# EAGLE schematic bracelet (EAGLE 9.6.2)
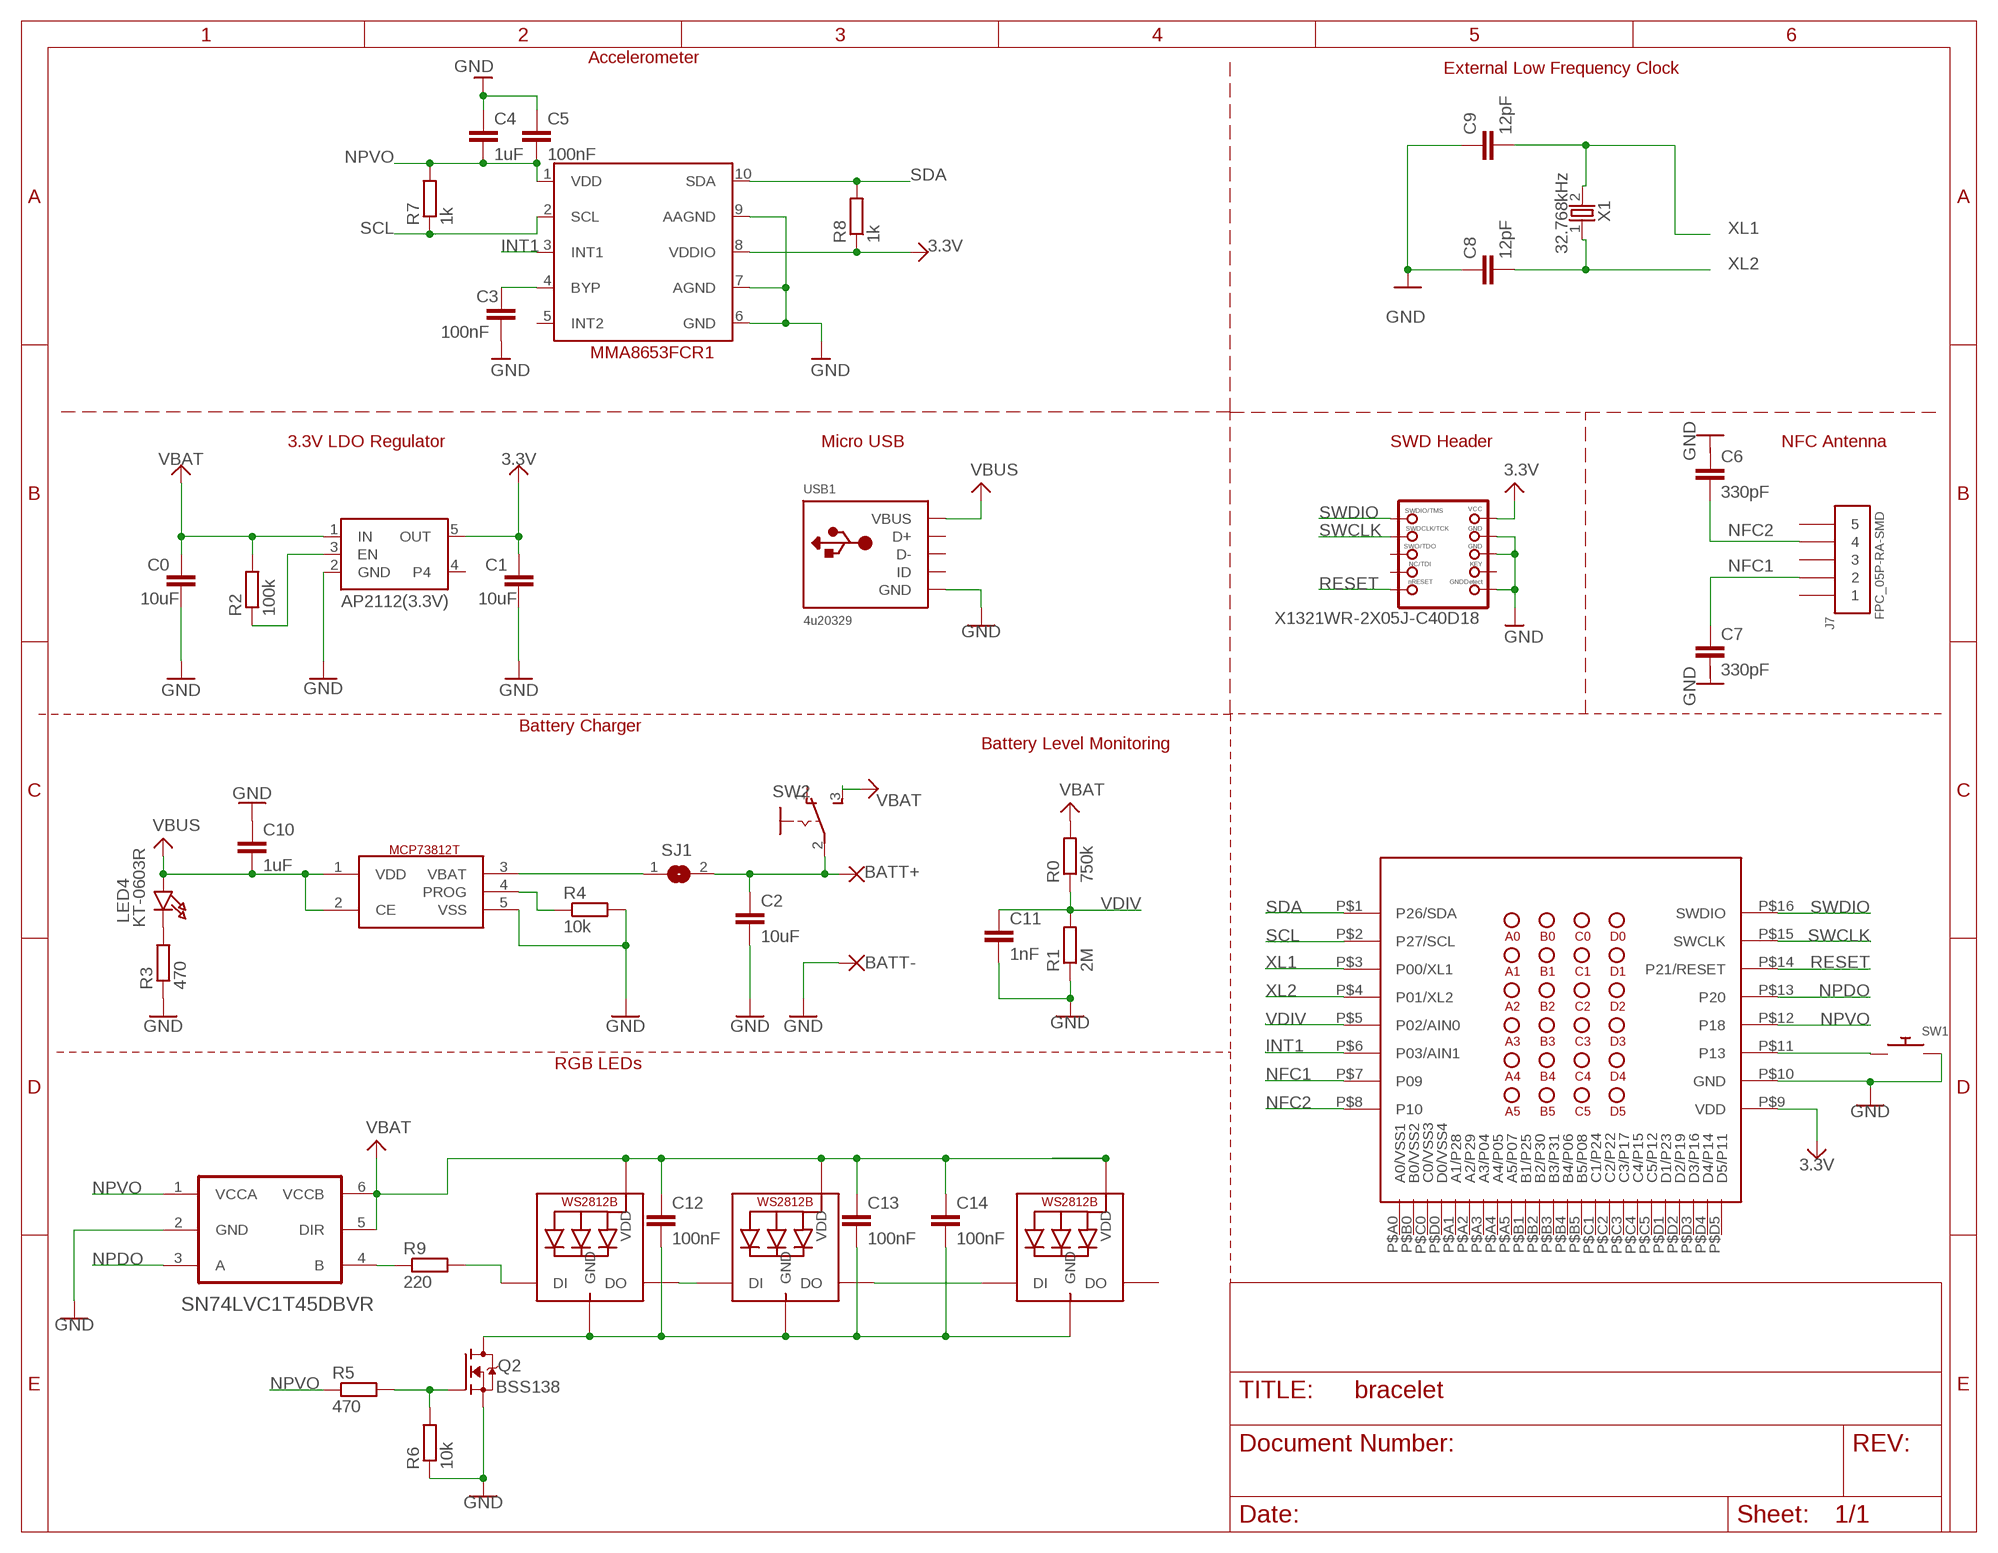
[diagram p0: schematic, sheet 1]

## Parts
BATT+  WIREPADSMD2,54-5,08  [SMD2,54-5,08]
BATT-  WIREPADSMD2,54-5,08  [SMD2,54-5,08]
C0  10uF  CAPACITOR_0402_N  [RESC0402_N]
C1  10uF  CAPACITOR_0402_N  [RESC0402_N]
C2  10uF  C-EUC0402  [C0402]
C3  100nF  C-EUC0402  [C0402]
C4  1uF  C-EUC0402  [C0402]
C5  100nF  C-EUC0402  [C0402]
C6  330pF  C-EUC0402  [C0402]
C7  330pF  C-EUC0402  [C0402]
C8  12pF  C-EUC0402  [C0402]
C9  12pF  C-EUC0402  [C0402]
C10  1uF  C-EUC0402  [C0402]
C11  1nF  C-EUC0402  [C0402]
C12  100nF  C-EUC0402  [C0402]
C13  100nF  C-EUC0402  [C0402]
C14  100nF  C-EUC0402  [C0402]
J1  X1321WR-2X05J-C40D18  JTAG-CORTEXBOXPOSTS  [2X05_1.27MM_BOX_POSTS]
J7  FPC_05P-RA-SMD  [FPC_05P-RA-SMD]
LED1  WS2812B5050  [WS2812B]
LED2  WS2812B5050  [WS2812B]
LED3  WS2812B5050  [WS2812B]
LED4  LED0805_NOOUTLINE  [CHIPLED_0805_NOOUTLINE]
MMA8653FCR1  MMA8653FCR1  [MMA8653FCR1]
Q2  BSS138  [SOT95P240X111-3N]
R0  750k  R-EU_R0603  [R0603]
R1  2M  R-EU_R0603  [R0603]
R2  100k  R-EU_R0402  [R0402]
R3  470  R-EU_R0402  [R0402]
R4  10k  R-EU_R0402  [R0402]
R5  470  R-EU_R0402  [R0402]
R6  10k  R-EU_R0402  [R0402]
R7  1k  R-EU_R0402  [R0402]
R8  1k  R-EU_R0402  [R0402]
R9  220  R-EU_R0402  [R0402]
SJ1  SJ  [SJ]
SW1  SWITCH_PUSHBUTTONSOFTTOUCHSMD_SJ  [PUSHBUTTON_SMD_SJ]
SW2  255SB  [255SB]
U1  BT832L  [BT832L]
U2  SN74LVC1T45DBVR  [SOT95P280X145-6N]
U3  AP2112(3.3V)  VREG_SOT23-5  [SOT23-5]
U$5  MCP73812T-420I/OT  [MCP73812T-420I/OT]
USB1  4u20329  USB_MICRO_20329_V2  [4UCONN_20329_V2]
X1  32.768kHz  XTAL_32KHZ  [XTAL_3215_N]

## Nets
3.3V: C1.1 J1.1(VCC) MMA8653FCR1.8(VDDIO) R8.1 U1.P$9(VDD) U3.5(OUT)
GND: BATT-.1(P) C0.2 C1.2 C2.2 C3.2 C4.1 C5.1 C8.1 C9.1 C10.1 C11.2 J1.3(GND) J1.5(GND) J1.9(GNDDETECT) MMA8653FCR1.6(GND) MMA8653FCR1.7(AGND) MMA8653FCR1.9(AAGND) Q2.2(S) R1.1 R3.1 R4.2 R6.1 SW1.P$2 U1.P$10(GND) U2.2(GND) U3.2(GND) U$5.5(VSS) USB1.BASE@1(GND) USB1.BASE@2(GND) USB1.GND USB1.SPRT@1(GND) USB1.SPRT@2(GND) USB1.SPRT@3(GND) USB1.SPRT@4(GND)
INT1: MMA8653FCR1.3(INT1) U1.P$6(P03/AIN1)
N$1: LED1.2-DOUT(DO) LED2.4-DIN(DI)
N$2: BATT+.1(P) C2.1 SJ1.2 SW2.2(P)
N$3: SW1.P$1 U1.P$11(P13)
N$4: R9.1 U2.4(B)
N$5: LED4.C R3.2
N$6: R2.1 U3.3(EN)
N$7: LED2.2-DOUT(DO) LED3.4-DIN(DI)
N$8: SJ1.1 U$5.3(VBAT)
N$10: Q2.1(G) R5.2 R6.2
N$11: LED1.4-DIN(DI) R9.2
N$12: R4.1 U$5.4(PROG)
N$13: C12.2 C13.2 C14.2 LED1.3-GND(GND) LED2.3-GND(GND) LED3.3-GND(GND) Q2.3(D)
N$14: C3.1 MMA8653FCR1.4(BYP)
NFC1: C7.1 J7.2 U1.P$7(P09)
NFC2: C6.2 J7.4 U1.P$8(P10)
NPDO: U1.P$13(P20) U2.3(A)
NPVO: C4.2 C5.2 MMA8653FCR1.1(VDD) R5.1 R7.2 U1.P$12(P18) U2.1(VCCA)
RESET: J1.10(NRESET) U1.P$14(P21/RESET)
SCL: MMA8653FCR1.2(SCL) R7.1 U1.P$2(P27/SCL)
SDA: MMA8653FCR1.10(SDA) R8.2 U1.P$1(P26/SDA)
SWCLK: J1.4(SWDCLK) U1.P$15(SWCLK)
SWDIO: J1.2(SWDIO) U1.P$16(SWDIO)
VBAT: C0.1 C12.1 C13.1 C14.1 LED1.1-VDD(VDD) LED2.1-VDD(VDD) LED3.1-VDD(VDD) R0.2 R2.2 SW2.3(S) U2.5(DIR) U2.6(VCCB) U3.1(IN)
VBUS [power]: C10.2 LED4.A U$5.1(VDD) U$5.2(CE) USB1.VBUS
VDIV: C11.1 R0.1 R1.2 U1.P$5(P02/AIN0)
XL1: C9.2 U1.P$3(P00/XL1) X1.2
XL2: C8.2 U1.P$4(P01/XL2) X1.1
Unconnected: C6.1 C7.2 J1.6(SWO) J1.7(KEY) J1.8(TDI) J7.1 J7.3 J7.5 LED3.2-DOUT(DO) MMA8653FCR1.5(INT2) SW2.1(O) U1.P$A0(A0/VSS1) U1.P$A1(A1/P28) U1.P$A2(A2/P29) U1.P$A3(A3/P04) U1.P$A4(A4/P05) U1.P$A5(A5/P07) U1.P$B0(B0/VSS2) U1.P$B1(B1/P25) U1.P$B2(B2/P30) U1.P$B3(B3/P31) U1.P$B4(B4/P06) U1.P$B5(B5/P08) U1.P$C0(C0/VSS3) U1.P$C1(C1/P24) U1.P$C2(C2/P22) U1.P$C3(C3/P17) U1.P$C4(C4/P15) U1.P$C5(C5/P12) U1.P$D0(D0/VSS4) U1.P$D1(D1/P23) U1.P$D2(D2/P19) U1.P$D3(D3/P16) U1.P$D4(D4/P14) U1.P$D5(D5/P11) U3.4 USB1.D+ USB1.D- USB1.ID

## Notes on the sheet
- Accelerometer
- External Low Frequency Clock
- MMA8653FCR1
- 3.3V LDO Regulator | Micro USB | SWD Header | NFC Antenna
- Battery Charger
- Battery Level Monitoring
- KT-0603R
- RGB LEDs

## Library data of the parts
BATT+ BATT- = wirepad:WIREPAD: Wire PAD connect wire on PCB
C0 C1 = Nordic_misc:CAPACITOR: Generic chip capacitor
C2-C14 = Capstone:C-EU: CAPACITOR, European symbol; SPICEPREFIX: C
J1 = microbuilder:JTAG-CORTEX: Serial Wire (SW-DP) Connector Standard 0.05" 10-pin connector is for use with the Cortex M and Cortex A SWD (serial wire debugger) interface (SW-DP) Connectors 2x05_1.27MM_SMT - Inexpensive surface-mount header with bare pins, compatible with standard 10-pin SWD cables (4UCON: 16846) 2x05_1.27MM_BOX_NOPOSTS - Polarised surface-mount box (4UCON with caps: 19735, without caps: 15117 2x05_1.27MM_BOX_POSTS - Polarised surface-mount box with mounting holes (4UCON: 20317) Pinout: http://infocenter.arm.com/help/topic/com.arm.doc.faqs/attached/13634/cortex_debug_connectors.pdf http://www.keil.com/peripherals/coresight/connectors.asp
J7 = Nordic_misc:FPC_05P-RA-SMD
LED1-LED3 = WS2812B:WS2812B: Check availability <https://pricing.snapeda.com/parts/WS2812B/Worldsemi/view-part?ref=eda>; AVAILABILITY: Not in stock; DESCRIPTION: Raspberry Pi HAT (40 pin) Wheeled Robotics Kit; MF: Worldsemi; MP: WS2812B; PACKAGE: None; PRICE: None
LED4 = microbuilder:LED: LED 0603 - 0603 Surface Mount Package 2mA: Green LED - Low Power (3.9mcd, 2ma, 1.7Vf) - Digikey: 475-2709-2-ND Orange LED - Low Power (9.8mcd, 2ma, 1.8Vf) - Digikey: 475-1194-2-ND Red LED - Low Power (5mcd, 2ma, 1.8Vf) - Digikey: 475-1195-2-ND Yellow LED - Low Power (7mcd, 2ma, 1.8Vf) - Digikey: 475-1196-2-ND 5mA: Blue LED - Low Power (17mcd, 5ma, 2.9Vf) - Digikey: LNJ937W8CRACT-ND 0805 - 0805 Surface Mount Package 2mA: Red LED (8.8mcd, 2mA, 1.8Vf, Clear) - Low Power [Digikey: 475-2510-1-ND] Green LED (5mcd, 2mA, 1.8Vf, Clear) - Low Power [Digikey: 475-2730-1-ND] Yellow LED (11.3mcd, 2mA, 1.8Vf, Clear) - Low Power [Digikey: 475-2555-1-ND] 20mA: Red LED (104mcd, 20mA, Diffused) - LS R976 [Digikey: 475-1278-6-ND] Red LED (12mcd, 20mA, 2.0Vf, Clear) - APT2012EC [Digikey: 754-1128-1-ND] Green LED (15mcd, 20mA, 2.2Vf, Clear) - APT2012GC [Digikey: 754-1131-1-ND] Orange LED (160mcd, 20mA, 2.1Vf, Clear) - APT2012SECK [Digikey: 754-1130-1-ND] 1206 - 1206 Surface Mount Package Green LED (26mcd, 20mA, Diffused) - LG N971 [Digikey: 475-1407-6-ND] Red LED (15mcd, 20mA, Diffused) - LH N974 [Digikey: 475-1416-6-ND] Cree - Cree High-Power Surface Mount LEDs XPEBWT-L1-0000-00D50 - White 111lm 350mA 2.9Vf 6200K 110° XTEAWT-00-0000-00000LEE3 - White 114lm 350mA 2.85Vf 5000K 115° Everlight - Everlight 45-21 Series Surface Mount LEDs 45-21/QK2C-B2832AC2CB2/2T - Warm White 2000mcd 20mA 3.25Vf 3050K 120° 45-21/LK2C-B38452C4CB2/2T - Nuetral White 2000mcd 20mA 3.25Vf 4150K 120° 45-21/LK2C-B50634C6CB2/2T - Cold White 2200mcd 20mA 3.25Vf 5650K 120° PLCC2 Reverse Mount LS T77K-J1L2-1-0-2-R18-Z - Red 11.25mcd 2mA 1.8Vf 630nm 120° LO T77K-L1M2-24-Z - Orange 19.6mcd 2mA 1.8Vf 606nm 120° LY T77K-K2M1-26-Z - Yellow 15.7mcd 2mA 1.8Vf 587nm 120°
MMA8653FCR1 = MMA8653FCR1:MMA8653FCR1: Check availability <https://pricing.snapeda.com/parts/MMA8653FCR1/NXP%20Semiconductors/view-part?ref=eda>; AVAILABILITY: In Stock; DESCRIPTION: Accelerometer Triple ±2g/±4g/±8g 2.5V 10-Pin DFN T/R; MF: NXP Semiconductors; MP: MMA8653FCR1; PACKAGE: None; PRICE: None; PURCHASE-URL: https://pricing.snapeda.com/search/part/MMA8653FCR1/?ref=eda
Q2 = BSS138:BSS138: N-Channel 50V 220mA (Ta) 360mW (Ta) Surface Mount SOT-23-3 Check availability <https://pricing.snapeda.com/parts/BSS138/ON%20Semiconductor/view-part?ref=eda>; AVAILABILITY: In Stock; DESCRIPTION: N-Channel 50 V 200mA (Ta) 225mW (Ta) Surface Mount SOT-23-3 (TO-236); MF: ON Semiconductor; MP: BSS138; PACKAGE: SOT-23 ON; PRICE: None; PURCHASE-URL: https://pricing.snapeda.com/search/part/BSS138/?ref=eda
R0 R1 = rcl:R-EU_: RESISTOR, European symbol; SPICEPREFIX: R
R2-R9 = Capstone:R-EU_: RESISTOR, European symbol; SPICEPREFIX: R
SJ1 = jumper:SJ: SMD solder JUMPER
SW1 = adafruit:SWITCH_PUSHBUTTON: Buttons SOFTTOUCHSMD_SJ - Soft touch temporary push button (Super Junk Akihabara) Compatible with SKPMANE010 [Mouser: 688-SKPMAN] C&K_KSS = Digikey: KSS221GLFS
SW2 = switch:255SB: SLIDING SWITCH Distributor Buerklin, 11G810
U1 = BT832:BT832L
U2 = SN74LVC1T45DBVR_edited:SN74LVC1T45DBVR: Check availability <https://pricing.snapeda.com/parts/SN74LVC1T45DBVR/Texas%20Instruments/view-part?ref=eda>; AVAILABILITY: In Stock; DESCRIPTION: Single-Bit Dual-Supply Bus Transceiver with Configurable Voltage-Level Shifting and 3-State Outputs; MF: Texas Instruments; MP: SN74LVC1T45DBVR; PACKAGE: SOT-23-6 Texas Instruments; PRICE: None; PURCHASE-URL: https://pricing.snapeda.com/search/part/SN74LVC1T45DBVR/?ref=eda
U3 = microbuilder:VREG_SOT23-5: SOT23-5 Fixed Voltage Regulators Part Current Out V Out V In V Dropout θJA (°C/W) TJ (°C) Digikey Part No. ADP121 150mA 3.3V 3.4-5.5V 0.09V @ 150mA -- -- ADP121-AUJZ33R7CT-ND ADP121 150mA 3.0V 3.1-5.5V 0.09V @ 150mA -- -- ADP121-AUJZ30R7CT-ND ADP122 300mA 3.3V 3.4-5.5V 0.085V @ 300mA -- -- ADP122AUJZ-3.3-R7CT-ND ADP1712 300mA 3.3V 3.5-5.5V 0.17V @ 300mA -- -- ADP1712AUJZ-3.3-R7TR-ND AP7311 (Low Cost) 150mA 3.3V 3.5-6V 0.15V @ 150mA -- -- AP7311-33WG-7DICT-ND LD39015M18R 150mA 1.8V 1.9V-5.5V 0.08V @ 100mA -- -- 497-6977-1-ND LP2985A-33DBVR 150mA 3.3V 3.3-16V 0.28V @ 150mA 206 150 296-18479-1-ND MCP1824T-3302E/OT 300mA 3.3V 3.5V-6V 0.2V @ 300mA -- -- MCP1824T-3302E/OTCT-ND MIC5205-2.5YM5 TR 150mA 2.5V 2.7-16V 0.165V @ 150mA -- -- 576-1257-2-ND MIC5205-3.0YM5 TR 150mA 3.0V 3.2V-16V 0.165V @ 150mA -- -- 576-1258-2-ND MIC5205-3.3YM5 TR 150mA 3.3V 3.5V-16V 0.165V @ 150mA -- -- 576-1259-2-ND TPS780330220 150mA 3.3V+2.2V 3.6-5.5V 250mV Max -- -- 296-23332-1-ND TDA3663/N1,135 100mA 3.3V 3.5-45V 0.18V @ 50mA -- -- 568-5343-1-ND Max operating temp can be calculated using θJA, TJ (max junction temperature), and power in watts. Set the "Maximum Ambient Temperature" until it reaches TJ ("Max Junction Temperature"), which is the absolute limit for safe use of the regulator: Heat Sink Temperature Calculator <http://www.daycounter.com/Calculators/Heat-Sink-Temperature-Calculator.phtml> For example, With 12V source into a 3.3V LP2985 and a 30mA load, we are dissipating (12V-3.3V) * 0.03A = 0.261W. With a θJA of 206 °C/W, a TJ of 150°C, and 261mW we can safely use the chip without a heat sink up to 75°C (=147.1°C Junction Temperature).
U$5 = custom:MCP73812T-420I/OT
USB1 = microbuilder:USB: USB Connectors USBMINIB - Surface Mount Female Mini-B USB Connector 4UConnector: 06564
X1 = Nordic_nRF:XTAL_32KHZ

## Net classes
1 power: width 0.254 mm